# EAGLE board MJ838 - rev.1a - TCAN334 - poc (EAGLE 9.6.2)
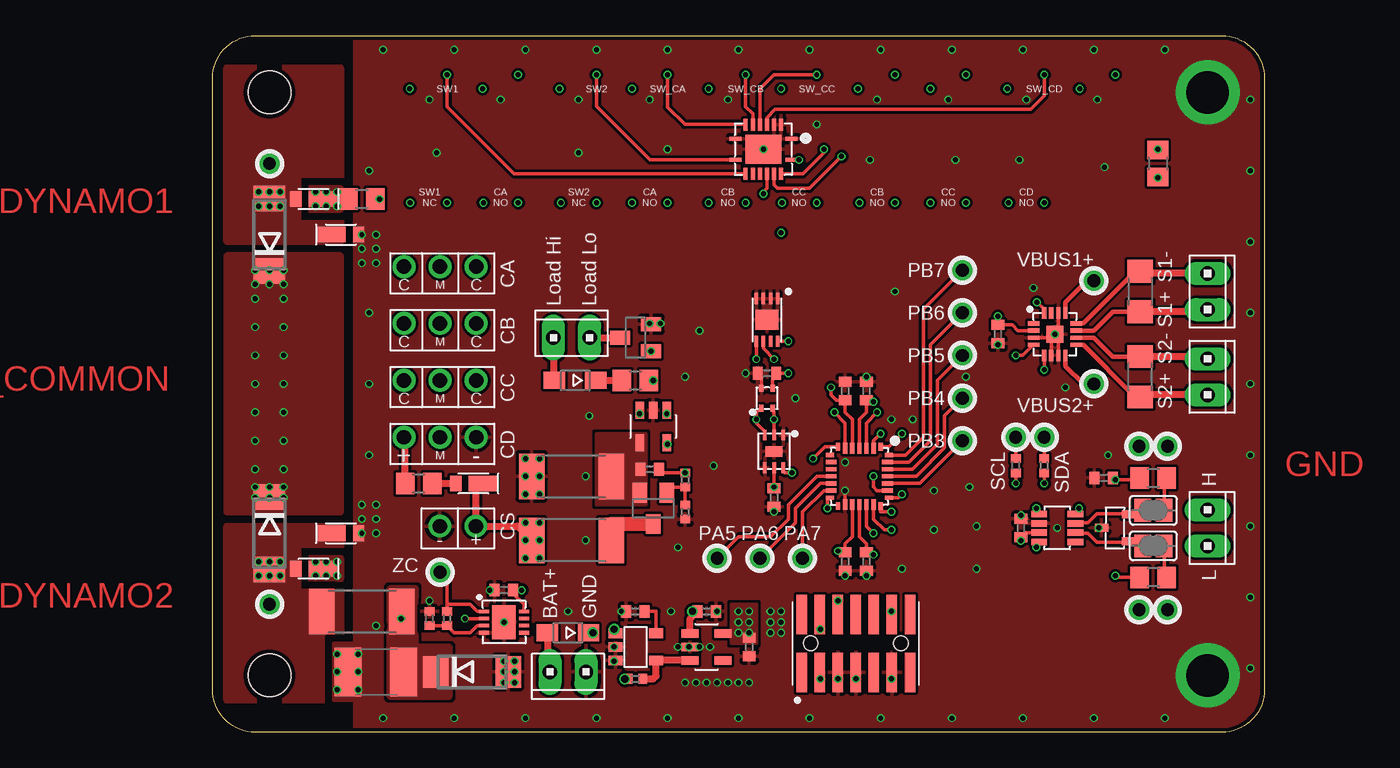
[diagram p19: board, top side]
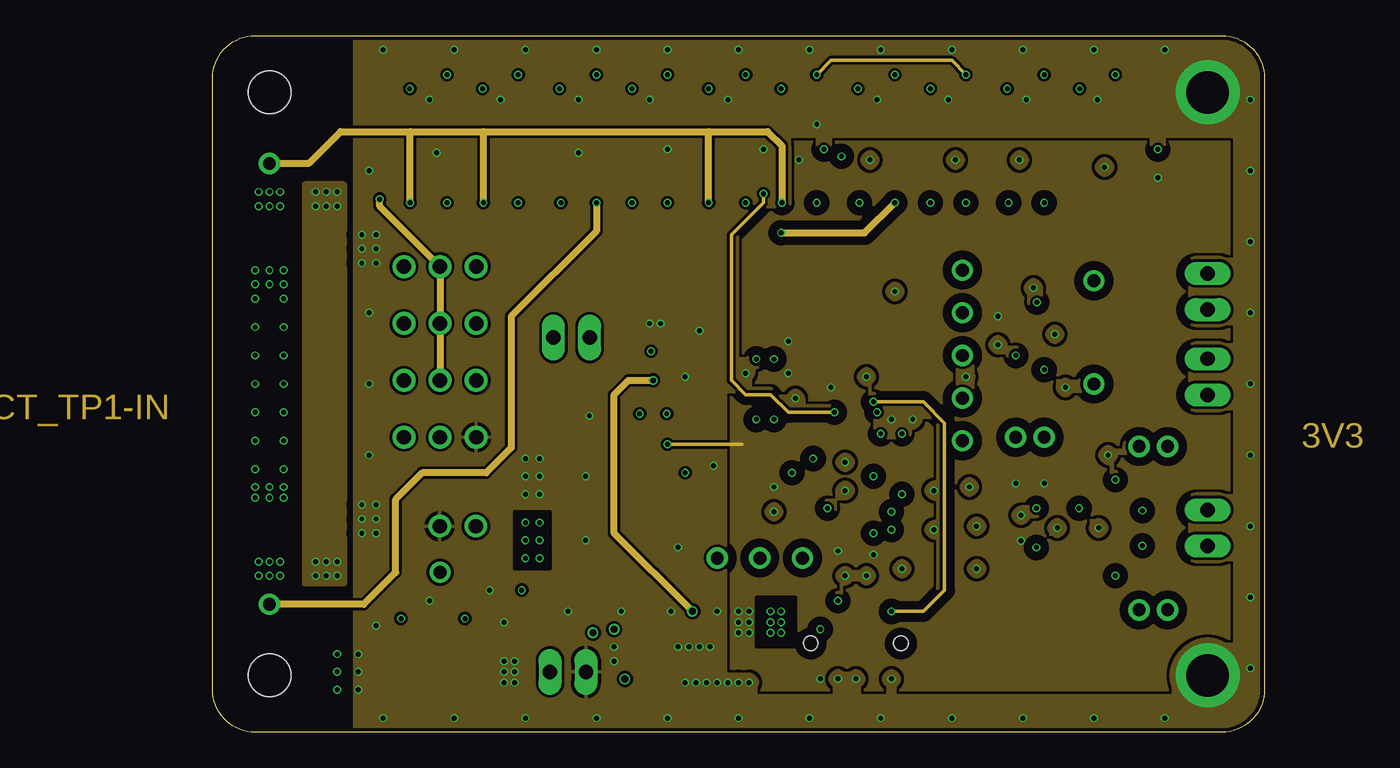
[diagram p20: board, inner layer Route2]
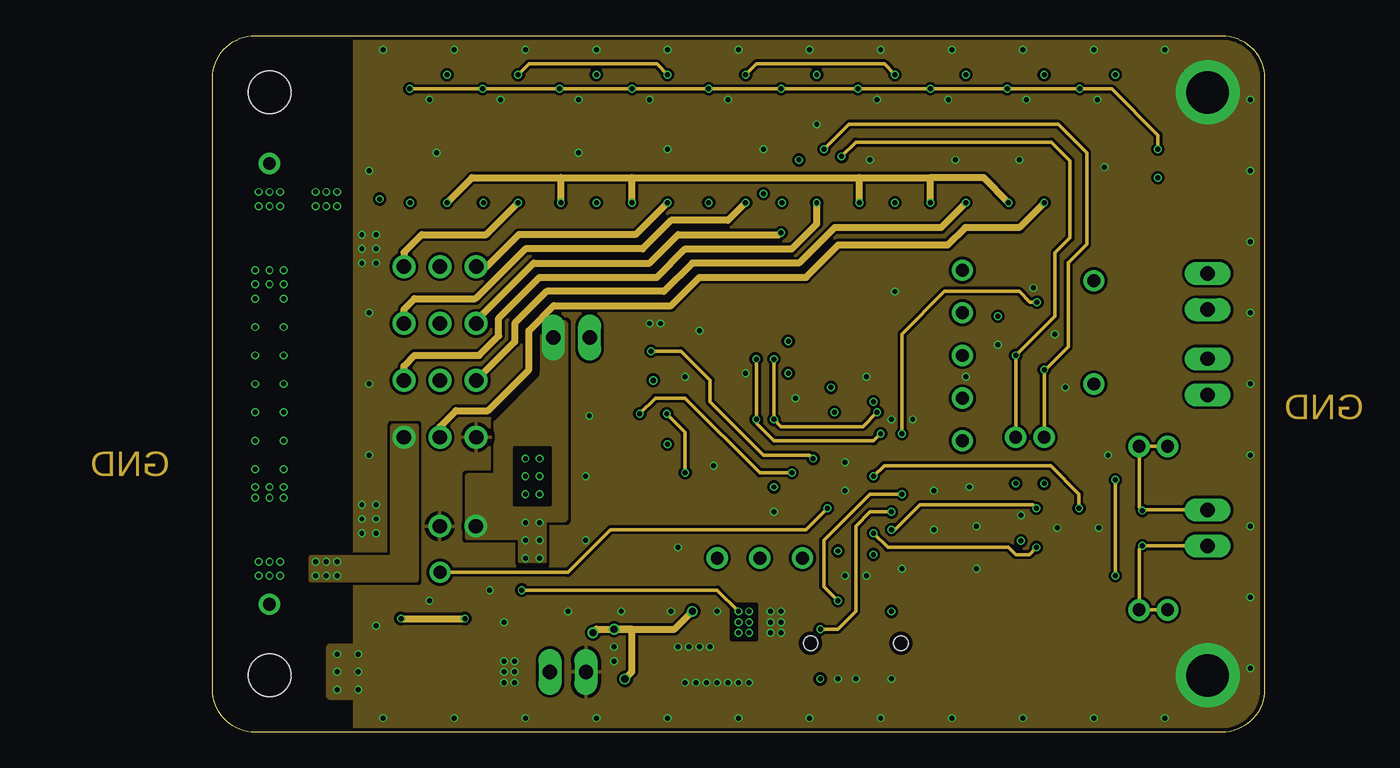
[diagram p21: board, inner layer Route15]
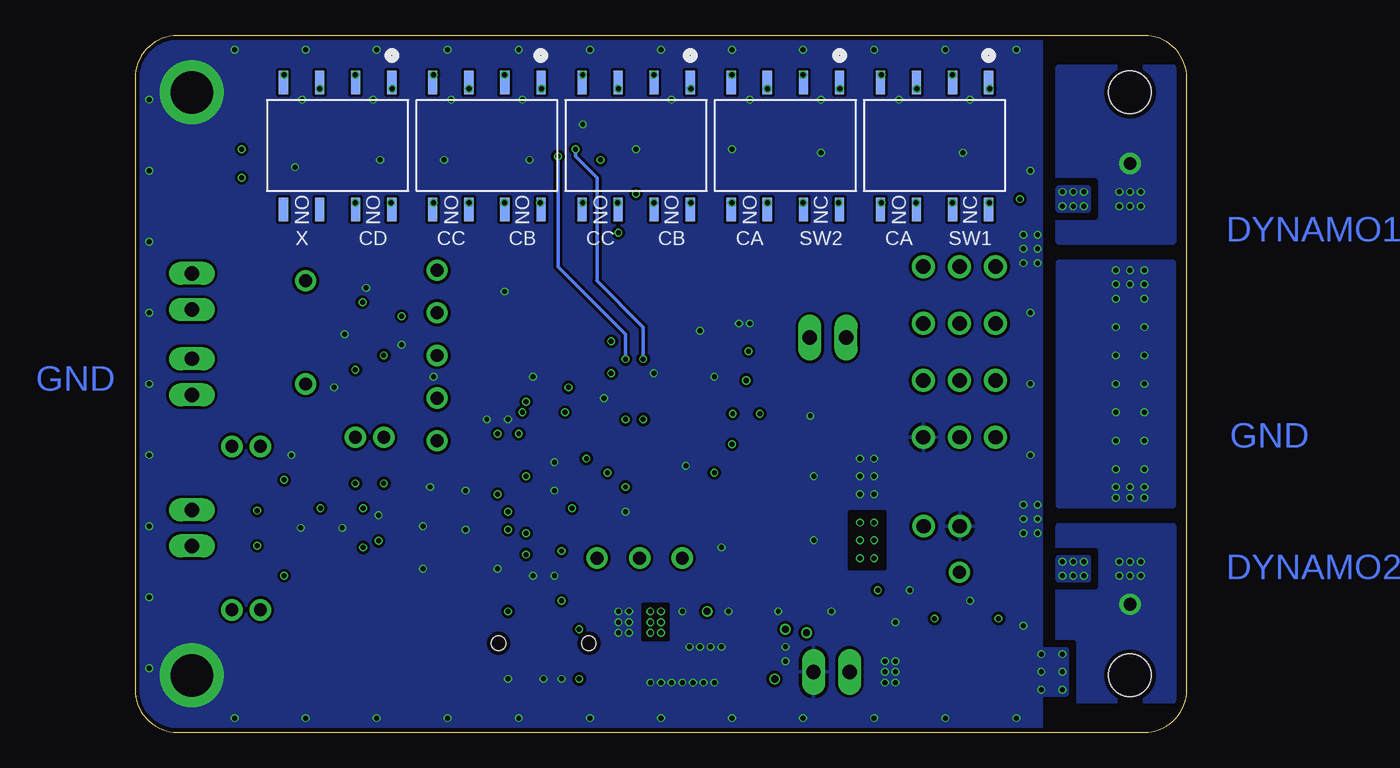
[diagram p22: board, bottom side, seen from below]

Size 74 x 49 mm. Coordinates in mm from the lower left corner, seen from the top.
Outline: 74,46 74,3 arc-90 71,0 3,0 arc-90 0,3 0,46 arc-90 3,49 71,49 arc-90 74,46
Copper layers (1+2*15+16): Top 0.035mm / dielectric 0.138mm / Route2 0.035mm / dielectric 1.13mm / Route15 0.035mm / dielectric 0.138mm / Bottom 0.035mm
Design rules "aisler_4_layer_complex": minimum track width 0.125mm, minimum drill 0.1mm, track to track 0.125mm, track to pad 0.125mm, pad to pad 0.125mm, via to via 0.125mm, smd to smd 0mil, copper to edge 0.3mm, drill to drill 0.3mm, minimum pad ring 0.3mm, minimum via ring 0.1mm, stop-mask expansion 0mil, vias tented up to drill 0mil, thermal gap 10mil
Net classes: 0 GND: width 0.25 mm, drill 0.35 mm, clearance 0.19 mm; 1 BAT+: width 0.5 mm, drill 0.35 mm, clearance 0.5 mm to class 0, clearance 0.5 mm; 2 signal: width 0.25 mm, drill 0.35 mm, clearance 0.19 mm to class 0, clearance 0.19 mm to class 1, clearance 0.19 mm; 3 3V3: width 0.25 mm, drill 0.35 mm, clearance 0.19 mm to class 0, clearance 0.19 mm to class 1, clearance 0.19 mm to class 2, clearance 0.19 mm; 4 VDC: width 0.5 mm, drill 0.35 mm, clearance 0.5 mm to class 0, clearance 0.5 mm to class 1, clearance 0.5 mm to class 2, clearance 0.5 mm to class 3, clearance 0.5 mm; 5 VDynamo: width 0.5 mm, drill 0.35 mm, clearance 0.5 mm to class 0, clearance 0.5 mm to class 1, clearance 0.5 mm to class 2, clearance 0.5 mm to class 3, clearance 0.5 mm to class 4, clearance 0.5 mm; 6 VAC: width 0.5 mm, drill 0.35 mm, clearance 0.5 mm to class 0, clearance 0.5 mm to class 1, clearance 0.5 mm to class 2, clearance 0.5 mm to class 3, clearance 0.5 mm to class 4, clearance 0.5 mm to class 5, clearance 0.5 mm
Holes 3 mm at 4,45 4,4
tKeepout: area 66.5,41.5 to 73.5,48.5; area 0.5,0.5 to 7.5,7.5; area 0.5,41.5 to 7.5,48.5; area 66.5,0.5 to 73.5,7.5
bKeepout: area 0.5,0.5 to 7.5,7.5; area 0.5,41.5 to 7.5,48.5; area 66.5,0.5 to 73.5,7.5; area 66.5,41.5 to 73.5,48.5
tRestrict: 9 lines

## Footprints (pad centres in the part's own frame; a part is rotated, then mirrored left to right if it is on the bottom)
10X02MTA = drill 1.016 long: 1 1.27,0; 2 -1.27,0
SOT23 = smd 1 x 1.4: 1 -0.95,-1.1; 2 0.95,-1.1; 3 0,1.1
C0402 = smd 0.7 x 0.9: 1 -0.65,0; 2 0.65,0
SOD323-W = smd 1.5 x 1.2: A 1.45,0; C -1.45,0
UFQFPN-28 = smd 0.55 x 0.3: 1_PB8 -2.08,1.5; 7_PA1 -2.08,-1.5; 15_PB1 2.08,-1.5; 21_PA13 2.08,1.5 | smd 0.75 x 0.3: 2_PF0 -1.98,1; 3_PF1 -1.98,0.5; 4_NRST -1.98,0; 5_VDDA -1.98,-0.5; 6_PA0 -1.98,-1; 16_VSS 1.98,-1; 17_VDD 1.98,-0.5; 18_VDDIO2 1.98,0; 19_PA9-[PA11] 1.98,0.5; 20_PA10-[PA12] 1.98,1 | smd 0.3 x 0.55: 8_PA2 -1.5,-2.08; 14_PB0 1.5,-2.08; 22_PA14 1.5,2.08; 28_PB7 -1.5,2.08 | smd 0.3 x 0.75: 9_PA3 -1,-1.98; 10_PA4 -0.5,-1.98; 11_PA5 0,-1.98; 12_PA6 0.5,-1.98; 13_PA7 1,-1.98; 23_PA15 1,1.98; 24_PB3 0.5,1.98; 25_PB4 0,1.98; 26_PB5 -0.5,1.98; 27_PB6 -1,1.98
SOT23-8 = smd 0.45 x 1.1: P$1 -0.975,-1.275; P$2 -0.325,-1.275; P$3 0.325,-1.275; P$4 0.975,-1.275; P$5 0.975,1.275; P$6 0.325,1.275; P$7 -0.325,1.275; P$8 -0.975,1.275
SOT-23-3 = smd 0.56 x 0.95: 1 -0.95,-0.95; 2 0.95,-0.95; 3 0,0.95
VQFN16 = smd 0.8 x 0.3: 1 -1.5,0.75; 2 -1.5,0.25; 3 -1.5,-0.25; 4 -1.5,-0.75; 9 1.5,-0.75; 10 1.5,-0.25; 11 1.5,0.25; 12 1.5,0.75 | smd 0.3 x 0.8: 5 -0.75,-1.5; 6 -0.25,-1.5; 7 0.25,-1.5; 8 0.75,-1.5; 13 0.75,1.5; 14 0.25,1.5; 15 -0.25,1.5; 16 -0.75,1.5 | smd 1.2 x 1.2: 17 0,0
SON-8 = smd 0.25 x 0.8: P$1 -0.75,-1.5; P$2 -0.25,-1.5; P$3 0.25,-1.5; P$4 0.75,-1.5; P$5 0.75,1.5; P$6 0.25,1.5; P$7 -0.25,1.5; P$8 -0.75,1.5 | smd 1.6 x 1.4: P$9 0,0
WSON-6 = smd 0.25 x 0.75: 1 -0.65,-1.15; 2 0,-1.15; 3 0.65,-1.15; 4 0.65,1.15; 5 0,1.15; 6 -0.65,1.15 | smd 1.2 x 0.75: 7 0,0
SOT-23-5 = smd 0.6 x 1.2: 1 0.95,1.15; 2 0,1.15; 3 -0.95,1.15; 4 -0.95,-1.15; 5 0.95,-1.15
SMD = smd 0.5 x 0.3: SCL -0.7,-0.4; SDA -0.7,0.4; VDD 0.7,-0.4; VSS 0.7,0.4
FTSH10701LDVKA = smd 0.74 x 2.79: 1 -3.81,-2.035; 2 -3.81,2.035; 3 -2.54,-2.035; 4 -2.54,2.035; 5 -1.27,-2.035; 6 -1.27,2.035; 7 0,-2.035; 8 0,2.035; 9 1.27,-2.035; 10 1.27,2.035; 11 2.54,-2.035; 12 2.54,2.035; 13 3.81,-2.035; 14 3.81,2.035 | hole 1.02: -3.175,0; 3.175,0
R0402 = smd 0.6 x 0.7: 1 -0.5,0; 2 0.5,0
R0805 = smd 1.3 x 1.5: 1 -0.95,0; 2 0.95,0
R1206 = smd 1.6 x 1.803: 1 -1.422,0; 2 1.422,0
R2512 = smd 1.8 x 3.2: 1 -2.8,0; 2 2.8,0
SOT23-5 = smd 0.7 x 1: 1_VDD -0.95,-1.4; 2_GND 0,-1.4; 3_GND 0.95,-1.4; 4_DOUT 0.95,1.45; 5_CD -0.95,1.45
SOT-23-5L = smd 0.6 x 1.2: ADJ/NC -0.95,-1.15; EN -0.95,1.15; GND 0,1.15; IN 0.95,1.15; OUT 0.95,-1.15
US2H = smd 2 x 1.1: A -1,0 | smd 0.8 x 1.1: C 0.9,0
TH-2S = drill 1.016: 1_POS -2.54,0; 2_MID 0,0; 3_NEG 2.54,0
SMD_DIP8 = smd 0.65 x 1.65: 1_ANODE1 -3.81,-4.44; 2_CATHODE1 -1.27,-4.44; 3_ANODE2 1.27,-4.44; 4_CATHODE2 3.81,-4.44; 5_DRAIN2-1 3.81,4.48; 6_DRAIN2-2 1.27,4.48; 7_DRAIN1-1 -1.27,4.48; 8_DRAIN1-2 -3.81,4.48
VQFN16' = smd 0.85 x 0.28: 1 -1.975,-0.75; 8 1.975,-0.75; 9 1.975,0.75; 16 -1.975,0.75 | smd 0.28 x 0.85: 2 -1.25,-1.725; 3 -0.75,-1.725; 4 -0.25,-1.725; 5 0.25,-1.725; 6 0.75,-1.725; 7 1.25,-1.725; 10 1.25,1.725; 11 0.75,1.725; 12 0.25,1.725; 13 -0.25,1.725; 14 -0.75,1.725; 15 -1.25,1.725 | smd 2.55 x 2.05: 17 0,0
TH-2S-BACK-TO-BACK = drill 1.016: 1_C -2.54,0; 2_MID 0,0; 3_C 2.54,0
DO214AA = smd 1.8 x 2.2: A 2.55,0; C -2.55,0
TH = drill 1: NEG -1.27,0; POS 1.27,0
C1812 = smd 1.9 x 3.4: 1 -1.95,0; 2 1.95,0
DFN-8 = smd 0.25 x 0.7: 1_A_OUT -0.75,-1.4; 2_A_IN- -0.25,-1.4; 3_A_IN+ 0.25,-1.4; 4_V- 0.75,-1.4; 5_B_IN+ 0.75,1.4; 6_B_IN- 0.25,1.4; 7_B_OUT -0.25,1.4; 8_V+ -0.75,1.4 | smd 2.38 x 1.65: 9_V- 0,0
SJ = smd 1.168 x 1.6: 1 -0.762,0; 2 0.762,0
TH-0.9 = drill 0.9: P$1 0,0

## Placement (x,y rotation side)
APP_LOAD:J3  Application  [10X02MTA]  25.25,27.75 0 top
APP_LOAD:Q2  IRLML2402TRPBF  [SOT23]  29.75,27.75 90 top
C301  0.1uF / 10V  [C0402]  44.5,12 90 top
C304  1uF / 10V  [C0402]  44.5,24 270 top
C305  0.1uF / 10V  [C0402]  46,12 90 top
C307  0.1uF / 10V  [C0402]  46,24 270 top
C401  47nF / 10V  [C0402]  62.67,17.89 180 top
C405  0.1uF / 10V  [C0402]  56.86,14.36 90 top
C605  0.1uF / 10V  [C0402]  55.25,28 270 top
C801  0.1uF / 10V  [C0402]  39.5,16.5 90 top
C802  0  [C0402]  30.75,18.5 0 top
C905  0.1uF / 10V  [C0402]  39,25.25 180 top
D501  BAT 60A E6327  [SOD323-W]  25,7 180 top
D502  BAT 60A E6327  [SOD323-W]  25.5,24.75 180 top
IC302  STM32F042G6U6  [UFQFPN-28]  45.5,18 270 top
IC401  TCAN334GDCNT  [SOT23-8]  59.42,14.37 270 top
IC402  SZNUP2105LT1G  [SOT-23-3]  63.48,14.37 90 top
IC602  PAC1952T-2E/4MX  [VQFN16]  59.25,28 0 top
IC701  MB85RC16PN-G-AMERE1  [SON-8]  39,29 180 top
IC801  DAC121C081CISD/NOPB  [WSON-6]  39.5,19.75 180 top
IC802  AD8515ARTZ-REEL7  [SOT-23-5]  31,21.5 0 top
IC901  SHT40-AD1F-R2  [SMD]  39,23.5 90 top
J1  Battery  [10X02MTA]  25,4.25 180 top
J2  FTSH-107-01-L-DV-K-A  [FTSH10701LDVKA]  45.25,6.25 0 top
J3  CAN  [10X02MTA]  70,14.38 270 top
J4  sense 1  [10X02MTA]  70,31 270 top
J5  sense 2  [10X02MTA]  70,25 270 top
Q802  IRLML2402TRPBF  [SOT23]  31,15.75 180 top
R1  4k7  [R0402]  56.5,18.75 270 top
R2  4k7  [R0402]  58.5,18.75 270 top
R401  60R, 0.5W  [R0805]  66.18,10.89 180 top
R402  60R, 0.5W  [R0805]  66.18,17.89 0 top
R502  0R  [R0805]  14.5,17.5 0 top
R504  0R  [R0805]  29.75,24.75 0 top
R601  0.1R / 0.5W / 0.25%  [R1206]  65.25,31 90 top
R602  0.1R / 0.5W / 0.25%  [R1206]  65.25,25 270 top
R801  12R/3W+++  [R2512]  25.25,13.5 180 top
R802  0.1R / 1W  [R2512]  25.25,18 0 top
R803  0R  [R0402]  33.25,17.75 270 top
R804  0R  [R0402]  33.25,15.5 270 top
RECTIFIER:3V3:C1  1uF / 10V  [C0402]  29.75,8.5 180 top
RECTIFIER:3V3:C2  1uF / 10V  [C0402]  34.75,8.5 0 top
RECTIFIER:3V3:C7  1uF / 10V  [C0402]  37.75,6 90 top
RECTIFIER:3V3:IC1  R3119N058A  [SOT23-5]  29.75,6 270 top
RECTIFIER:3V3:IC2  LDK320AM33R  [SOT-23-5L]  34.75,6 90 top
RECTIFIER:3V3:R1  100k / 0.1W  [R0402]  29.75,3.75 0 top
RECTIFIER:GRAETZ+DELON:D1  CUHS20S30,H3F  [US2H]  6.75,37.5 180 top
RECTIFIER:GRAETZ+DELON:D2  CUHS20S30,H3F  [US2H]  9.38,35 0 top
RECTIFIER:GRAETZ+DELON:D3  CUHS20S30,H3F  [US2H]  6.75,11.5 180 top
RECTIFIER:GRAETZ+DELON:D4  CUHS20S30,H3F  [US2H]  9.38,14 0 top
RECTIFIER:GRAETZ+DELON:DELON:C1  330μF / 35V / ultralow ESR  [TH-2S]  16,20.75 0 top
RECTIFIER:GRAETZ+DELON:DELON:SSR_NO/NO3:IC1  LAA710S  [SMD_DIP8]  59.75,41.25 180 bottom
RECTIFIER:GRAETZ+DELON:IC1  TLC59208FIRGYR  [VQFN16']  38.75,41 180 top
RECTIFIER:GRAETZ+DELON:R1  430R/0.5W  [R0805]  66.5,40 270 top
RECTIFIER:GRAETZ+DELON:TUNING_CAPS:C2  1500μF / 35V / ultralow ESR  [TH-2S-BACK-TO-BACK]  16,32.75 0 top
RECTIFIER:GRAETZ+DELON:TUNING_CAPS:C3  1500μF / 35V / ultralow ESR  [TH-2S-BACK-TO-BACK]  16,28.75 0 top
RECTIFIER:GRAETZ+DELON:TUNING_CAPS:C4  1500μF / 35V / ultralow ESR  [TH-2S-BACK-TO-BACK]  16,24.75 0 top
RECTIFIER:GRAETZ+DELON:TUNING_CAPS:R2  47k  [R0805]  10.5,37.5 180 top
RECTIFIER:GRAETZ+DELON:TUNING_CAPS:SSR_NC/NO1:IC2  LBA710S  [SMD_DIP8]  17.75,41.25 180 bottom
RECTIFIER:GRAETZ+DELON:TUNING_CAPS:SSR_NC/NO2:IC2  LBA710S  [SMD_DIP8]  28.25,41.25 180 bottom
RECTIFIER:GRAETZ+DELON:TUNING_CAPS:SSR_NO/NO1:IC1  LAA710S  [SMD_DIP8]  38.75,41.25 180 bottom
RECTIFIER:GRAETZ+DELON:TUNING_CAPS:SSR_NO/NO2:IC1  LAA710S  [SMD_DIP8]  49.25,41.25 180 bottom
RECTIFIER:OVP:D1  19V/5W  [DO214AA]  4,35 90 top
RECTIFIER:OVP:D2  19V/5W  [DO214AA]  4,14 270 top
RECTIFIER:SMOOTHING_CAP:C5  2P 4700μF / 35V / ultralow ESR  [TH]  17.25,14.5 0 top
RECTIFIER:SMOOTHING_CAP:D8  CUHS20S30,H3F  [US2H]  18,17.5 180 top
RECTIFIER:ZERO-CROSS_DETECTOR:C3  0.1uF / 10V  [C0402]  20.5,10 0 top
RECTIFIER:ZERO-CROSS_DETECTOR:C8  10nF / 100v  [C1812]  11.5,4.25 0 top
RECTIFIER:ZERO-CROSS_DETECTOR:D10  6V/3W  [DO214AA]  18.25,4.25 0 top
RECTIFIER:ZERO-CROSS_DETECTOR:IC1  LT1638IDD#PBF  [DFN-8]  20.5,7.75 270 top
RECTIFIER:ZERO-CROSS_DETECTOR:R1  10k/3W  [R2512]  10.5,8.5 0 top
RECTIFIER:ZERO-CROSS_DETECTOR:R2  10k  [R0402]  15.25,8 270 top
RECTIFIER:ZERO-CROSS_DETECTOR:R7  10k  [R0402]  16.5,8 270 top
SJ401  CAN H term.  [SJ]  66.18,15.61 0 top
SJ402  CAN L term.  [SJ]  66.18,13.11 0 top
TP2  CAN high  [TH-0.9]  4,40 90 top
TP3  CAN high  [TH-0.9]  4,9 90 top
TP4  CAN high  [TH-0.9]  52.75,20.5 270 top
TP5  CAN high  [TH-0.9]  52.75,23.5 180 top
TP6  CAN high  [TH-0.9]  52.75,26.5 180 top
TP7  CAN high  [TH-0.9]  52.75,29.5 180 top
TP8  CAN high  [TH-0.9]  52.75,32.5 180 top
TP10  CAN high  [TH-0.9]  41.5,12.25 270 top
TP11  CAN high  [TH-0.9]  38.5,12.25 270 top
TP12  CAN high  [TH-0.9]  35.5,12.25 270 top
TP16  CAN high  [TH-0.9]  65.18,20.11 270 top
TP17  CAN high  [TH-0.9]  67.18,20.11 270 top
TP18  CAN low  [TH-0.9]  65.18,8.61 270 top
TP19  CAN low  [TH-0.9]  67.18,8.61 270 top
TP22  CAN high  [TH-0.9]  56.5,20.75 270 top
TP23  CAN high  [TH-0.9]  58.5,20.75 270 top
TP24  CAN high  [TH-0.9]  62,31.75 0 top
TP25  CAN high  [TH-0.9]  62,24.5 0 top
TP31  BAT+  [TH-0.9]  16,11.25 180 top

## Tracks (layer width: path | path; a pad name or v marks a point on that pad's centre or on a via)
3V3  (via drill 0.35)
  Top 0.25: v55.25,29.25 C605.1 56.25,28.65 56.65,28.25 IC602.2 | RECTIFIER:GRAETZ+DELON:R1.2 v66.5,39 | J2.3 42.75,4.17 v42.75,3.75 | v46.5,12.5 46.35,12.65 C305.2 46,13.25 45.5,13.75 IC302.18_VDDIO2 | v44,12.75 44.1,12.65 C301.2 44.5,13.25 45,13.75 IC302.17_VDD | IC302.5_VDDA 45,22 44.5,22.5 C304.2 43.9,23.35 43.5,23.75 v43.5,24.25 | RECTIFIER:GRAETZ+DELON:IC1.16 v41.25,40.25 | v40.5,25.25 C905.1 39.65,25 39.4,24.75 IC901.VDD | IC701.P$8 v40.5,27.5 | v56.86,13.46 C405.1 57.2,14.05 IC401.P$3 | v56.5,17.5 R1.2 | v58.5,17.5 R2.2 | IC801.5 v39.5,17.25 C801.2 | v21.75,10 RECTIFIER:ZERO-CROSS_DETECTOR:C3.2 21.15,9.75 21.9,9 RECTIFIER:ZERO-CROSS_DETECTOR:IC1.8_V+ | IC802.5 32,20.3 v32,20.25
  Route2 0.25: v32,20.25 37.25,20.25
  Route15 0.25: v21.75,10 35.5,10 v37,8.5
  other vias: 37.75,8.5 37.75,7.75 37.75,7 37,7.75 37,7
  pour Route2 (isolate 0.61, rank 2): 36.5,41.5 71.5,41.5 71.5,3 36.5,3
  pour Top (rank 2, no thermals): 36.5,9 38.25,9 38.25,6.25 36.5,6.25
12R_OHMIC_LOAD:DAC_OUT  (via drill 0.35)
  Top 0.25: v40.75,18.25 40.25,18.25 40.15,18.35 IC801.6 | IC802.3 v30.05,22.4
  Route15 0.25: v40.75,18.25 38.5,18.25 33.25,23.5 31.15,23.5 v30.05,22.4
12R_OHMIC_LOAD:GATE1
  Top 0.25: Q802.1 31.95,17.25 R803.2 R804.1
12R_OHMIC_LOAD:LOAD_LOW
  Top 0.5: R801.1 28.05,14.65
  Top 1: 28.05,14.65 Q802.3
12R_OHMIC_LOAD:OPAMP_OUT  (via drill 0.35)
  Top 0.25: C802.2 31.4,18.25 R803.1 | IC802.1 v31.95,22.4
  Route15 0.25: v31.95,22.4 33.25,21.1 R803.1
  other vias: 33.25,18.25
12R_OHMIC_LOAD:VSENSE
  pour Top (rank 2, no thermals): 27,16 27,21 30.5,21 30.5,16
!APP_LOAD!  (via drill 0.35)
  Top 0.25: IC302.7_PA1 43.08,20.08 v42.25,19.25
  Route15 0.25: APP_LOAD:Q2.1 32.95,26.8 35,24.75 35,23.25 38.75,19.5 42,19.5 v42.25,19.25
  other vias: 30.85,26.8
!LED_RST!  (via drill 0.35)
  Top 0.25: IC302.6_PA0 44.5,21.75 v43.75,22.5 | RECTIFIER:GRAETZ+DELON:IC1.13 39,38.25 38.75,38 v38.75,37.88
  Route2 0.25: v38.75,37.88 38.75,37.23 36.5,34.98 36.5,24.75 37.5,23.75 39.25,23.75 40.5,22.5 v43.75,22.5
!STBY!  (via drill 0.35)
  Top 0.25: IC302.23_PA15 46.75,17 46.48,17.27 46.48,17.98 v46.5,18 | v60.96,15.75 60.96,15.61 IC401.P$8
  Route15 0.25: v60.96,15.75 60.96,16.75 58.96,18.75 47.25,18.75 v46.5,18
APP_LOAD:LOAD_LOW
  Top 0.5: APP_LOAD:J3.1 APP_LOAD:Q2.3
BAT+
  Top 0.5: D501.A 23.55,4.43 J1.1
CAN_H  (via drill 0.35)
  Top 0.25: IC401.P$7 60.75,14.75 61.58,14.75 62.21,15.39 64.36,15.39 IC402.2 65.13,15.32 v65.4,15.6 SJ401.1
  Route15 0.25: TP17.P$1 TP16.P$1 65.18,15.82 v65.4,15.6 65.45,15.64 J3.2
CAN_INFRA:H
  Top 0.25: SJ401.2 66.94,17.7 R402.2
CAN_INFRA:L
  Top 0.25: SJ402.2 66.94,11.08 R401.1
CAN_INFRA:SPLIT  (via drill 0.35)
  Top 0.25: C401.1 63.46,17.75 v63.5,17.75 65.09,17.75 R402.1 | R401.2 63.61,10.89 v63.5,11
  Route15 0.25: v63.5,11 v63.5,17.75
CAN_L  (via drill 0.35)
  Top 0.25: IC401.P$6 60.75,13.99 61.58,13.99 62.21,13.36 64.36,13.36 IC402.1 65.11,13.42 SJ402.1
  Route15 0.25: TP19.P$1 TP18.P$1 65.18,12.87 SJ402.1 J3.1
  other vias: 65.42,13.11
CAN_RX  (via drill 0.35)
  Top 0.25: IC302.19_PA9-[PA11] 46,14.5 v46.5,14 | v57.96,13 58.14,13.19 IC401.P$4
  Route15 0.25: v57.96,13 57.46,12.5 56.5,12.5 56,13 47.5,13 v46.5,14
CAN_TX  (via drill 0.35)
  Top 0.25: IC302.20_PA10-[PA12] 46.5,15 47.25,14.25 v47.75,14.25 | v57.96,15.75 58.14,15.75 IC401.P$1
  Route15 0.25: v57.96,15.75 57.71,16 49.75,16 48,14.25 v47.75,14.25
DYNAMO1  (via drill 0.35)
  Route2 0.5: v40.05,37.25 40.05,41.25 39.05,42.25 34.9,42.25 | TP2.P$1 6.75,40 9,42.25 13.9,42.25 | v13.9,37.25 13.9,42.25 | 13.9,42.25 19.05,42.25 | 19.05,42.25 34.9,42.25 | v19.05,37.25 19.05,42.25 | v34.9,37.25 34.9,42.25
  Bottom 0.5: RECTIFIER:GRAETZ+DELON:TUNING_CAPS:SSR_NC/NO1:IC2.6_DRAIN2-2 19.02,37.25 v19.05,37.25 | RECTIFIER:GRAETZ+DELON:TUNING_CAPS:SSR_NC/NO1:IC2.8_DRAIN1-2 13.94,37.25 v13.9,37.25 | RECTIFIER:GRAETZ+DELON:TUNING_CAPS:SSR_NO/NO1:IC1.8_DRAIN1-2 34.9,36.77 v34.9,37.25 | RECTIFIER:GRAETZ+DELON:TUNING_CAPS:SSR_NO/NO1:IC1.6_DRAIN2-2 40.02,37.25 v40.05,37.25
  other vias: 3.25,37 3.25,38 4.75,38 4.75,37 4,37 4,38
  pour Top (rank 2, no thermals): 1,34.5 1,46.75 9,46.75 9,34.5
  pour Bottom (rank 2, no thermals): 9,34.5 9,46.75 1,46.75 1,34.5
DYNAMO2  (via drill 0.35)
  Route2 0.5: v27,37.25 27,35.25 21,29.25 21,20 19.25,18.25 14.75,18.25 12.88,16.38 12.88,11.25 10.62,9 TP3.P$1
  Bottom 0.5: RECTIFIER:GRAETZ+DELON:TUNING_CAPS:SSR_NC/NO2:IC2.7_DRAIN1-1 26.98,37.23 v27,37.25
  other vias: 3.25,12 4,12 4.75,12 4.75,11 4,11 3.25,11
  pour Top (rank 2, no thermals): 1,14.5 9,14.5 9,2.25 1,2.25
  pour Bottom (rank 2, no thermals): 9,14.5 1,14.5 1,2.25 9,2.25
E
  cutout Bottom: 36.5,9 38.25,9 38.25,6.5 36.5,6.5
  cutout Route15: 36.5,9 38.25,9 38.25,6.5 36.5,6.5
  cutout Route15: 21.25,20 23.75,20 23.75,16 21.25,16
GND  (via drill 0.35, 3)
  Top 0.25: v44.5,17 IC302.16_VSS | IC602.14 59.5,28.25 IC602.17 | IC602.3 59,27.75 | IC602.6 59,27.75 | 59,27.75 IC602.17 | IC602.7 59.5,27.75 IC602.17 | IC901.VSS 38.6,25 C905.2
  other vias: 20.5,7.75 59.42,14.37 70,45 70,4 42,48 42,1 73,24.5 47,1 52,1 57,1 62,1 67,1 37,1 32,1 27,1 22,1 17,1 12,1 47,48 52,48 57,48 62,48 67,48 37,48 32,48 27,48 22,48 17,48 12,48 73,29.5 73,34.5 73,39.5 73,19.5 56.88,15.26 73,9.5 10.5,34 11.5,34 10.5,33 11.5,33 10.5,35 11.5,35 10.5,15 10.5,14 11.5,14 11.5,15 11.5,16 10.5,16 11,24.5 11,29.5 11,39.5 11,19.5 11.5,7.5 8.75,3 8.75,4.25 8.75,5.5 21.25,3.5 21.25,5 34.25,6 28.25,5 46,25 44.5,11 46,11 10.25,4.25 10.25,3 10.25,5.5 73,4.5 73,44.5 44,3.75 45.25,3.75 47.75,3.75 37.5,25.25 63,19.5 55.25,27.25 35.5,8.5 28.75,8.5 28.25,6 21.25,4.25 33.5,6 32.75,6 35,6 57.75,31.25 60,24.25 62.33,14.37 59.25,28 22,16.75 23,16.75 22,18 23,18 22,19.25 23,19.25 39.5,15.5 38.75,41 48.5,11.5 53,25 48,31 56.75,40.25 42.5,42.75 25.75,40.75 15.75,40.75 73,14.5 30.75,28.75 31.5,28.75 19.5,10 15.25,9.25 52.25,40.25 46.25,40.25 46.75,44.5 51.75,44.5 57.25,44.5 62.25,44.5 36.25,44.5 30.75,44.5 25.75,44.5 20.25,44.5 15.25,44.5 32,41 53.75,11.5 50.75,14.25 53.25,17.25 26.5,22.25 26.25,18 26.25,13.5 32.75,13 33.25,25 32.25,8.5 33.25,3.5 34.75,3.5 36.25,3.5 25,8.5 39.25,8.5 40,8.5 40,7.75 39.25,7.75 39.25,7 40,7 34,3.5 35.5,3.5 37.75,3.5 37,3.5 34.25,28.25 49.25,22 47.75,22 50.75,17 53.75,14.5 35.25,18.75 20.5,5 20.5,4.25 20.5,3.5 44.5,19 41,23.5 62.75,39.75
  pour Top (rank 6): 10,50 75,50 75,-1 10,-1
  pour Bottom (rank 5): 10.25,50 75,50 75,-1 10.25,-1
  pour Route15 (rank 6): 10,50 75,50 75,-1 10,-1
  pour Bottom (no thermals): 8.5,2.75 8.5,5.75 10.75,5.75 10.75,2.75
  pour Top (no thermals): 10.75,2.25 10.75,6.25 8.5,6.25 8.5,2.25
  pour Top (no thermals): 11.25,13 11.25,15 10,15 10,13
  pour Top (no thermals): 11.25,34 11.25,36 10,36 10,34
  pour Route2 (rank 6): 10,50 75,50 75,-1 10,-1
  pour Route15: 8.25,6 10.75,6 10.75,2.5 8.25,2.5
  cutout Bottom (no thermals): 21.25,11.5 21.25,15.5 23.75,15.5 23.75,11.5
  cutout Route2 (no thermals): 21.25,11.5 21.25,15.5 23.75,15.5 23.75,11.5
  cutout Route2 (no thermals): 38.25,6 38.25,9.5 41,9.5 41,6
I2C_SCL  (via drill 0.35)
  Top 0.25: v56.5,26.5 57,26.5 IC602.4 | v44.25,40.5 42,38.25 39.75,38.25 39.5,38.5 RECTIFIER:GRAETZ+DELON:IC1.14 | IC302.3_PF1 46,21.75 v46.75,22.5 | IC801.2 v39.5,22 39.5,22.5 39.4,22.6 IC901.SCL | v39.5,26.25 38.75,27 IC701.P$6 | R1.1 TP22.P$1
  Route15 0.25: v46.75,22.5 45.75,21.5 40,21.5 v39.5,22 v39.5,26.25 | v44.25,40.5 45.25,41.5 59,41.5 60.31,40.19 60.31,34.77 59.26,33.72 59.26,29.26 v56.5,26.5 TP22.P$1
  Bottom 0.25: v39.5,26.25 39.5,28 44.25,32.75 v44.25,40.5
I2C_SDA  (via drill 0.35)
  Top 0.25: IC602.5 v58.5,25.5 | v43,41 43,40.75 41.52,39.27 RECTIFIER:GRAETZ+DELON:IC1.15 | IC302.2_PF0 46.5,20.5 v47,21 | IC801.3 38.85,21.15 38.25,21.75 v38.25,22 38.25,22.5 38.55,22.8 IC901.SDA | v38.25,26.25 IC701.P$5 | R2.1 TP23.P$1
  Route15 0.25: v47,21 46.5,20.5 39.5,20.5 38.25,21.75 v38.25,22 v38.25,26.25 | TP23.P$1 v58.5,25.5 58.59,25.5 60.2,27.11 60.2,33.04 61.5,34.34 61.5,40.75 59.5,42.75 44.75,42.75 v43,41
  Bottom 0.25: v38.25,26.25 38.25,28.5 41.5,31.75 41.5,39 43,40.5 v43,41
PA5
  Top 0.25: IC302.11_PA5 42.5,18 40.5,16 40.5,15 39.25,13.75 37,13.75 TP12.P$1
PA6
  Top 0.25: IC302.12_PA6 42.75,17.5 41,15.75 41,14.75 TP11.P$1
PA7
  Top 0.25: TP10.P$1 41.5,15.5 43,17 IC302.13_PA7
PB3
  Top 0.25: IC302.24_PB3 49.75,17.5 TP4.P$1
PB4
  Top 0.25: IC302.25_PB4 49.5,18 51.5,20 51.5,22.25 TP5.P$1
PB5
  Top 0.25: IC302.26_PB5 49.25,18.5 51,20.25 51,24.75 TP6.P$1
PB6
  Top 0.25: IC302.27_PB6 49,19 50.5,20.5 50.5,27.25 TP7.P$1
PB7
  Top 0.25: IC302.28_PB7 48.75,19.5 50,20.75 50,29.75 TP8.P$1
PM_!PWRDN!  (via drill 0.35)
  Top 0.25: v58,30.25 58.5,29.75 IC602.16 | v48.5,21 47.58,20.08 IC302.1_PB8
  Route15 0.25: v58,30.25 57.5,30.25 56.75,31 51.5,31 48.5,28 v48.5,21
RECTIFIER:3V3:!EN!
  Top 0.5: RECTIFIER:3V3:IC2.EN RECTIFIER:3V3:IC1.4_DOUT 31.2,3.95 31,3.75 RECTIFIER:3V3:R1.2
RECTIFIER:3V3:CD
  Top 0.25: RECTIFIER:3V3:IC1.5_CD 31.2,8.5 RECTIFIER:3V3:C1.1
RECTIFIER:GRAETZ+DELON:!SW1!  (via drill 0.35)
  Top 0.25: v16.5,46.25 16.5,44 21.23,39.27 RECTIFIER:GRAETZ+DELON:IC1.10
  Bottom 0.25: RECTIFIER:GRAETZ+DELON:TUNING_CAPS:SSR_NC/NO1:IC2.2_CATHODE1 16.5,45.71 v16.5,46.25
RECTIFIER:GRAETZ+DELON:!SW2!  (via drill 0.35)
  Top 0.25: v27,46.25 27,44.02 30.77,40.25 RECTIFIER:GRAETZ+DELON:IC1.9
  Bottom 0.25: RECTIFIER:GRAETZ+DELON:TUNING_CAPS:SSR_NC/NO2:IC2.2_CATHODE1 27,45.71 v27,46.25
RECTIFIER:GRAETZ+DELON:!SW_CA!  (via drill 0.35)
  Top 0.25: v32,46.25 32,43.98 33.23,42.75 37.5,42.75 RECTIFIER:GRAETZ+DELON:IC1.7
  Route15 0.25: v32,46.25 31.25,47 22.25,47 v21.5,46.25
  Bottom 0.25: RECTIFIER:GRAETZ+DELON:TUNING_CAPS:SSR_NC/NO2:IC2.4_CATHODE2 32,45.75 v32,46.25 | RECTIFIER:GRAETZ+DELON:TUNING_CAPS:SSR_NC/NO1:IC2.4_CATHODE2 21.5,45.75 v21.5,46.25
RECTIFIER:GRAETZ+DELON:!SW_CB!  (via drill 0.35)
  Top 0.25: RECTIFIER:GRAETZ+DELON:IC1.6 38,43.5 37.5,44 v37.5,46.25
  Route15 0.25: v37.5,46.25 38.25,47 47.25,47 v48,46.25
  Bottom 0.25: RECTIFIER:GRAETZ+DELON:TUNING_CAPS:SSR_NO/NO2:IC1.2_CATHODE1 48,45.71 v48,46.25 | RECTIFIER:GRAETZ+DELON:TUNING_CAPS:SSR_NO/NO1:IC1.2_CATHODE1 37.5,45.71 v37.5,46.25
RECTIFIER:GRAETZ+DELON:!SW_CC!  (via drill 0.35)
  Top 0.25: RECTIFIER:GRAETZ+DELON:IC1.5 38.5,45.25 39.5,46.25 v42.5,46.25
  Route2 0.25: v42.5,46.25 43.5,47.25 52,47.25 v53,46.25
  Bottom 0.25: RECTIFIER:GRAETZ+DELON:TUNING_CAPS:SSR_NO/NO2:IC1.4_CATHODE2 53.06,46.19 v53,46.25 | RECTIFIER:GRAETZ+DELON:TUNING_CAPS:SSR_NO/NO1:IC1.4_CATHODE2 42.5,45.75 v42.5,46.25
RECTIFIER:GRAETZ+DELON:!SW_CD!  (via drill 0.35)
  Top 0.25: v58.5,46.25 58.5,44.75 57.56,43.81 39.58,43.81 39,43.23 RECTIFIER:GRAETZ+DELON:IC1.4
  Bottom 0.25: RECTIFIER:GRAETZ+DELON:DELON:SSR_NO/NO3:IC1.2_CATHODE1 58.5,45.71 v58.5,46.25
RECTIFIER:GRAETZ+DELON:DELON  (via drill 0.35)
  Route15 0.5: 24.5,39 29.5,39 | 29.5,39 45.5,39 | 45.5,39 50.5,39 | v45.5,37.25 45.5,39 | v50.5,37.25 50.5,39 | v24.5,37.25 24.5,39 | v29.5,37.25 29.5,39 | v16.5,37.25 18.25,39 24.5,39 | v56,37.25 54.25,39 50.5,39
  Bottom 0.5: RECTIFIER:GRAETZ+DELON:TUNING_CAPS:SSR_NC/NO2:IC2.8_DRAIN1-2 24.5,36.77 v24.5,37.25 | v29.5,37.25 29.5,36.79 RECTIFIER:GRAETZ+DELON:TUNING_CAPS:SSR_NC/NO2:IC2.6_DRAIN2-2 | v16.5,37.25 16.5,36.79 RECTIFIER:GRAETZ+DELON:TUNING_CAPS:SSR_NC/NO1:IC2.7_DRAIN1-1 | RECTIFIER:GRAETZ+DELON:TUNING_CAPS:SSR_NO/NO2:IC1.8_DRAIN1-2 45.5,36.77 v45.5,37.25 | RECTIFIER:GRAETZ+DELON:TUNING_CAPS:SSR_NO/NO2:IC1.6_DRAIN2-2 50.52,37.23 v50.5,37.25 | v56,37.25 56,36.83 RECTIFIER:GRAETZ+DELON:DELON:SSR_NO/NO3:IC1.8_DRAIN1-2
RECTIFIER:GRAETZ+DELON:DELON:SSR_NO/NO3:SW2_CAT  (via drill 0.35)
  Bottom 0.25: RECTIFIER:GRAETZ+DELON:DELON:SSR_NO/NO3:IC1.4_CATHODE2 63.5,45.75 v63.5,46.25
RECTIFIER:GRAETZ+DELON:DELON:SW1_OUT  (via drill 0.35)
  Route15 0.5: v58.5,37.25 56.75,35.5 52.95,35.5 51.73,34.27 44.02,34.27 41.75,32 34.25,32 32.25,30 24,30 22.25,28.25 22.25,25.5 19.38,22.62 17.12,22.62 16,21.5 RECTIFIER:GRAETZ+DELON:DELON:C1.2_MID
  Bottom 0.5: RECTIFIER:GRAETZ+DELON:DELON:SSR_NO/NO3:IC1.7_DRAIN1-1 58.48,37.23 v58.5,37.25
RECTIFIER:GRAETZ+DELON:SSR_ANODE  (via drill 0.35)
  Top 0.25: RECTIFIER:GRAETZ+DELON:R1.1 v66.5,41
  Route15 0.25: v13.88,45.25 v19,45.25 v24.4,45.25 v29.5,45.25 v34.9,45.25 v40,45.25 v45.4,45.25 v50.5,45.25 v55.9,45.25 v61,45.25 63.25,45.25 66.5,42 v66.5,41
  Bottom 0.25: RECTIFIER:GRAETZ+DELON:DELON:SSR_NO/NO3:IC1.3_ANODE2 61.02,45.25 v61,45.25 | RECTIFIER:GRAETZ+DELON:DELON:SSR_NO/NO3:IC1.1_ANODE1 55.94,45.25 v55.9,45.25 | v50.5,45.25 50.52,45.25 RECTIFIER:GRAETZ+DELON:TUNING_CAPS:SSR_NO/NO2:IC1.3_ANODE2 | v45.4,45.25 45.44,45.25 RECTIFIER:GRAETZ+DELON:TUNING_CAPS:SSR_NO/NO2:IC1.1_ANODE1 | v40,45.25 40.02,45.25 RECTIFIER:GRAETZ+DELON:TUNING_CAPS:SSR_NO/NO1:IC1.3_ANODE2 | v34.9,45.25 34.94,45.25 RECTIFIER:GRAETZ+DELON:TUNING_CAPS:SSR_NO/NO1:IC1.1_ANODE1 | v29.5,45.25 29.52,45.25 RECTIFIER:GRAETZ+DELON:TUNING_CAPS:SSR_NC/NO2:IC2.3_ANODE2 | v24.4,45.25 24.44,45.25 RECTIFIER:GRAETZ+DELON:TUNING_CAPS:SSR_NC/NO2:IC2.1_ANODE1 | v13.88,45.25 13.94,45.25 RECTIFIER:GRAETZ+DELON:TUNING_CAPS:SSR_NC/NO1:IC2.1_ANODE1 | RECTIFIER:GRAETZ+DELON:TUNING_CAPS:SSR_NC/NO1:IC2.3_ANODE2 19.02,45.27 v19,45.25
RECTIFIER:GRAETZ+DELON:TUNING_CAPS:CAA  (via drill 0.35)
  Route15 0.5: RECTIFIER:GRAETZ+DELON:TUNING_CAPS:C2.1_C 13.46,33.75 14.71,35 19.25,35 v21.5,37.25
  Bottom 0.5: RECTIFIER:GRAETZ+DELON:TUNING_CAPS:SSR_NC/NO1:IC2.5_DRAIN2-1 21.5,36.83 v21.5,37.25
RECTIFIER:GRAETZ+DELON:TUNING_CAPS:CAB  (via drill 0.35)
  Route15 0.5: RECTIFIER:GRAETZ+DELON:TUNING_CAPS:C2.3_C 19.29,32.75 21.54,35 29.75,35 v32,37.25
  Bottom 0.5: RECTIFIER:GRAETZ+DELON:TUNING_CAPS:SSR_NC/NO2:IC2.5_DRAIN2-1 32,36.83 v32,37.25
RECTIFIER:GRAETZ+DELON:TUNING_CAPS:CBA  (via drill 0.35)
  Route15 0.5: RECTIFIER:GRAETZ+DELON:TUNING_CAPS:C3.1_C 13.46,29.75 14.21,30.5 18.5,30.5 22,34 30.25,34 32.25,36 36.25,36 v37.5,37.25
  Bottom 0.5: RECTIFIER:GRAETZ+DELON:TUNING_CAPS:SSR_NO/NO1:IC1.7_DRAIN1-1 37.48,37.23 v37.5,37.25
RECTIFIER:GRAETZ+DELON:TUNING_CAPS:CBB  (via drill 0.35)
  Route2 0.5: v40,35.12 45.88,35.12 v48,37.25
  Route15 0.5: RECTIFIER:GRAETZ+DELON:TUNING_CAPS:C3.3_C 18.54,28.95 22.59,33 30.75,33 32.75,35 39.88,35 v40,35.12
  Bottom 0.5: v48,37.25 47.98,37.23 RECTIFIER:GRAETZ+DELON:TUNING_CAPS:SSR_NO/NO2:IC1.7_DRAIN1-1
RECTIFIER:GRAETZ+DELON:TUNING_CAPS:CCA  (via drill 0.35)
  Route15 0.5: RECTIFIER:GRAETZ+DELON:TUNING_CAPS:C4.1_C 13.46,25.75 14.21,26.5 18.75,26.5 20.12,27.88 20.12,29.12 23,32 31.25,32 33.25,34 40.75,34 42.5,35.75 v42.5,37.25
  Bottom 0.5: RECTIFIER:GRAETZ+DELON:TUNING_CAPS:SSR_NO/NO1:IC1.5_DRAIN2-1 42.56,37.19 v42.5,37.25
RECTIFIER:GRAETZ+DELON:TUNING_CAPS:CCB  (via drill 0.35)
  Route15 0.5: v53,37.25 51.25,35.5 43.75,35.5 41.25,33 33.75,33 31.75,31 23.5,31 21.25,28.75 21.25,27.46 RECTIFIER:GRAETZ+DELON:TUNING_CAPS:C4.3_C
  Bottom 0.5: RECTIFIER:GRAETZ+DELON:TUNING_CAPS:SSR_NO/NO2:IC1.5_DRAIN2-1 53,36.83 v53,37.25
RECTIFIER:GRAETZ+DELON:TUNING_CAPS:TUNING_CAP_BIAS  (via drill 0.35)
  Top 0.5: RECTIFIER:GRAETZ+DELON:TUNING_CAPS:R2.1 v11.75,37.5
  Route2 0.5: v11.75,37.5 11.75,37 RECTIFIER:GRAETZ+DELON:TUNING_CAPS:C2.2_MID RECTIFIER:GRAETZ+DELON:TUNING_CAPS:C3.2_MID RECTIFIER:GRAETZ+DELON:TUNING_CAPS:C4.2_MID
RECTIFIER:LDO_IN  (via drill 0.4, 0.5)
  Top 0.5: v33.75,8.5 RECTIFIER:3V3:C2.1 33.6,8 RECTIFIER:3V3:IC2.IN | RECTIFIER:3V3:IC1.1_VDD 28.25,6.95 v28.25,7.25 | RECTIFIER:3V3:R1.1 v29,3.75 | R504.2 v31,24.75 | D501.C v26.75,7
  Route2 0.5: v33.75,8.5 28.25,14 28.25,23.75 29.25,24.75 v31,24.75
  Route15 0.5: v28.25,7.25 32.5,7.25 v33.75,8.5 | v29,3.75 29.5,4.25 29.5,7.25 v28.25,7.25 | v26.75,7 27,7.25 v28.25,7.25
RECTIFIER:OVP:ZENER_COMMON  (via drill 0.35)
  other vias: 3,30.5 5,30.5 3,28.5 5,28.5 3,26.5 5,26.5 3,24.5 5,24.5 3,22.5 5,22.5 3,20.5 5,20.5 3,18.5 5,18.5 3,16.5 5,16.5 3,32.5 5,32.5 4,32.5 3,31.5 4,31.5 5,31.5 4,16.5 4,17.25 3,17.25 5,17.25
  pour Top (isolate 0.254, no thermals): 1,15.5 9,15.5 9,33.5 1,33.5
  pour Bottom (isolate 0.254, no thermals): 9,16 1,16 1,33 9,33
RECTIFIER:SMOOTHINGCAP_IN
  Top 0.5: R502.2 RECTIFIER:SMOOTHING_CAP:D8.C
RECTIFIER:V_RECT_TP1-IN  (via drill 0.35)
  Top 0.5: R502.1 13.55,20.75 RECTIFIER:GRAETZ+DELON:DELON:C1.1_POS
  other vias: 7.25,12 8,11 8.75,11 8.75,12 8,12 7.25,11 7.25,37 8,37 8.75,37 8.75,38 8,38 7.25,38
  pour Route2 (isolate 0.813): 6.5,38.5 6.5,10.5 9.25,10.5 9.25,38.5
  pour Top (no thermals): 6.75,38.25 9,38.25 9,36.75 6.75,36.75
  pour Bottom (no thermals): 9,38.25 7,38.25 7,36.75 9,36.75
  pour Top (no thermals): 6.75,12.25 9,12.25 9,10.75 6.75,10.75
  pour Bottom (no thermals): 9,12.25 7,12.25 7,10.75 9,10.75
  pour Route15 (no thermals): 12.75,21.5 14.25,21.5 14.25,10.75 7,10.75 7,12.25 12.75,12.25
RECTIFIER:VDC_TOWARDS_LDO
  Top 0.5: D502.C R504.1
RECTIFIER:ZERO-CROSS_DETECTOR:OPAMP_IN+
  Top 0.25: RECTIFIER:ZERO-CROSS_DETECTOR:R2.2 RECTIFIER:ZERO-CROSS_DETECTOR:R7.2 17,7 18.1,7 18.6,7.5 RECTIFIER:ZERO-CROSS_DETECTOR:IC1.3_A_IN+
RECTIFIER:ZERO-CROSS_DETECTOR:OPAMP_IN-  (via drill 0.35)
  Top 0.25: RECTIFIER:ZERO-CROSS_DETECTOR:IC1.2_A_IN- v17.75,8
  Route15 0.5: v13.25,8 v17.75,8
  pour Top (rank 2, no thermals): 12.5,2.5 12.5,10.12 14.25,10.12 14.25,6 16.62,6 16.62,2.5
SENSE1+
  Top 0.3: R601.1 63.33,29.58 62,28.25 IC602.11
  Top 0.5: J4.1 69.85,29.58 R601.1
SENSE1-
  Top 0.3: 64.92,32.42 61.25,28.75 IC602.12
  Top 0.5: 64.92,32.42 R601.2 65.4,32.27 J4.2
SENSE2+
  Top 0.3: R602.1 63.33,26.42 62,27.75 IC602.10
  Top 0.5: J5.2 69.85,26.42 R602.1
SENSE2-
  Top 0.3: 65,23.75 64.75,23.75 61.25,27.25 IC602.9 | 64.92,23.83 64.92,23.58 R602.2
  Top 0.5: J5.1 65.02,23.73 65,23.75 64.92,23.83
SYS_NRST  (via drill 0.35)
  Top 0.25: IC302.4_NRST 45.5,22 46,22.5 C307.2 46.1,23.25 v46.5,23.25 | J2.12 47.75,8.32 v47.75,8.5
  Route2 0.25: v46.5,23.25 50,23.25 51.5,21.75 51.5,10 50,8.5 v47.75,8.5
SYS_SWCLK  (via drill 0.35)
  Top 0.25: v44,9.25 44,8.3 J2.6 | v48.5,16.75 48.25,16.5 IC302.22_PA14
  Route15 0.25: v48.5,16.75 46.25,16.75 43,13.5 43,10.25 v44,9.25
SYS_SWDIO  (via drill 0.35)
  Top 0.25: v42.75,7.25 42.71,7.29 J2.4 | IC302.21_PA13 47,15.5 v47.75,15.5
  Route15 0.25: v47.75,15.5 46.25,15.5 45.25,14.5 45.25,8.5 44,7.25 v42.75,7.25
VBUS1+
  Top 0.3: TP24.P$1 61.5,31.75 60,30.25 IC602.13
VBUS2+
  Top 0.3: TP25.P$1 61.25,24.5 60,25.75 IC602.8
VDC  (via drill 0.35)
  Top 0.5: RECTIFIER:SMOOTHING_CAP:D8.A 18.52,17.5 RECTIFIER:SMOOTHING_CAP:C5.POS 21.45,14.5 R801.2 | APP_LOAD:J3.2 23.98,24.82 D502.A
  other vias: 23,14.75 22,14.75 22,12.25 23,12.25 23,13.5 22,13.5
  pour Route15 (rank 2, no thermals): 23.25,28.75 24.75,28.75 24.75,15 23.25,15 23.25,12 21.75,12 21.75,13.75 18,13.75 18,18 20,18 20,21.75 23.25,25
ZEROCROSS  (via drill 0.35)
  Top 0.25: IC302.14_PB0 43.25,16.5 v43.25,15.75 | RECTIFIER:ZERO-CROSS_DETECTOR:IC1.1_A_OUT 18.6,8.5 18.1,9 16.5,9 RECTIFIER:ZERO-CROSS_DETECTOR:R7.1 16.5,10.75 TP31.P$1
  Route15 0.25: TP31.P$1 25,11.25 28,14.25 41.75,14.25 v43.25,15.75

## Text on the board
Top: GND | DYNAMO1 | RECTIFIER:OVP:ZENER_COMMON | GND | DYNAMO2 | GND
Route2: 3V3 | RECTIFIER:V_RECT_TP1-IN | 3V3 | 3V3
Route15: GND | GND | GND | GND
Bottom: GND | DYNAMO1 | GND | GND | DYNAMO2 | GND
tPlace: SW1 | CA | SW2 | CA | CB | CC | CB | CC | CD | NC | NO | NC | NO | NO | NO | NO | NO | NO | PB7 | VBUS1+ | S1- | CA | Load Hi | Load Lo | S1+ | PB6 | CB | PB5 | S2- | CC | S2+ | PB4 | VBUS2+ | PB3 | CD | SCL | SDA | H | CS | PA5 | PA6 | PA7 | ZC | L | BAT+ | GND
bPlace: NC | NO | NC | NO | NO | NO | NO | NO | NO | NO | SW1 | CA | SW2 | CA | CB | CC | CB | CC | CD | X
tNames: SW1 | SW2 | SW_CA | SW_CB | SW_CC | SW_CD
tStop: mj838 - Čos / HW rev.1a